# Altium schematic sheet MotionDetector.SchDoc
size A4
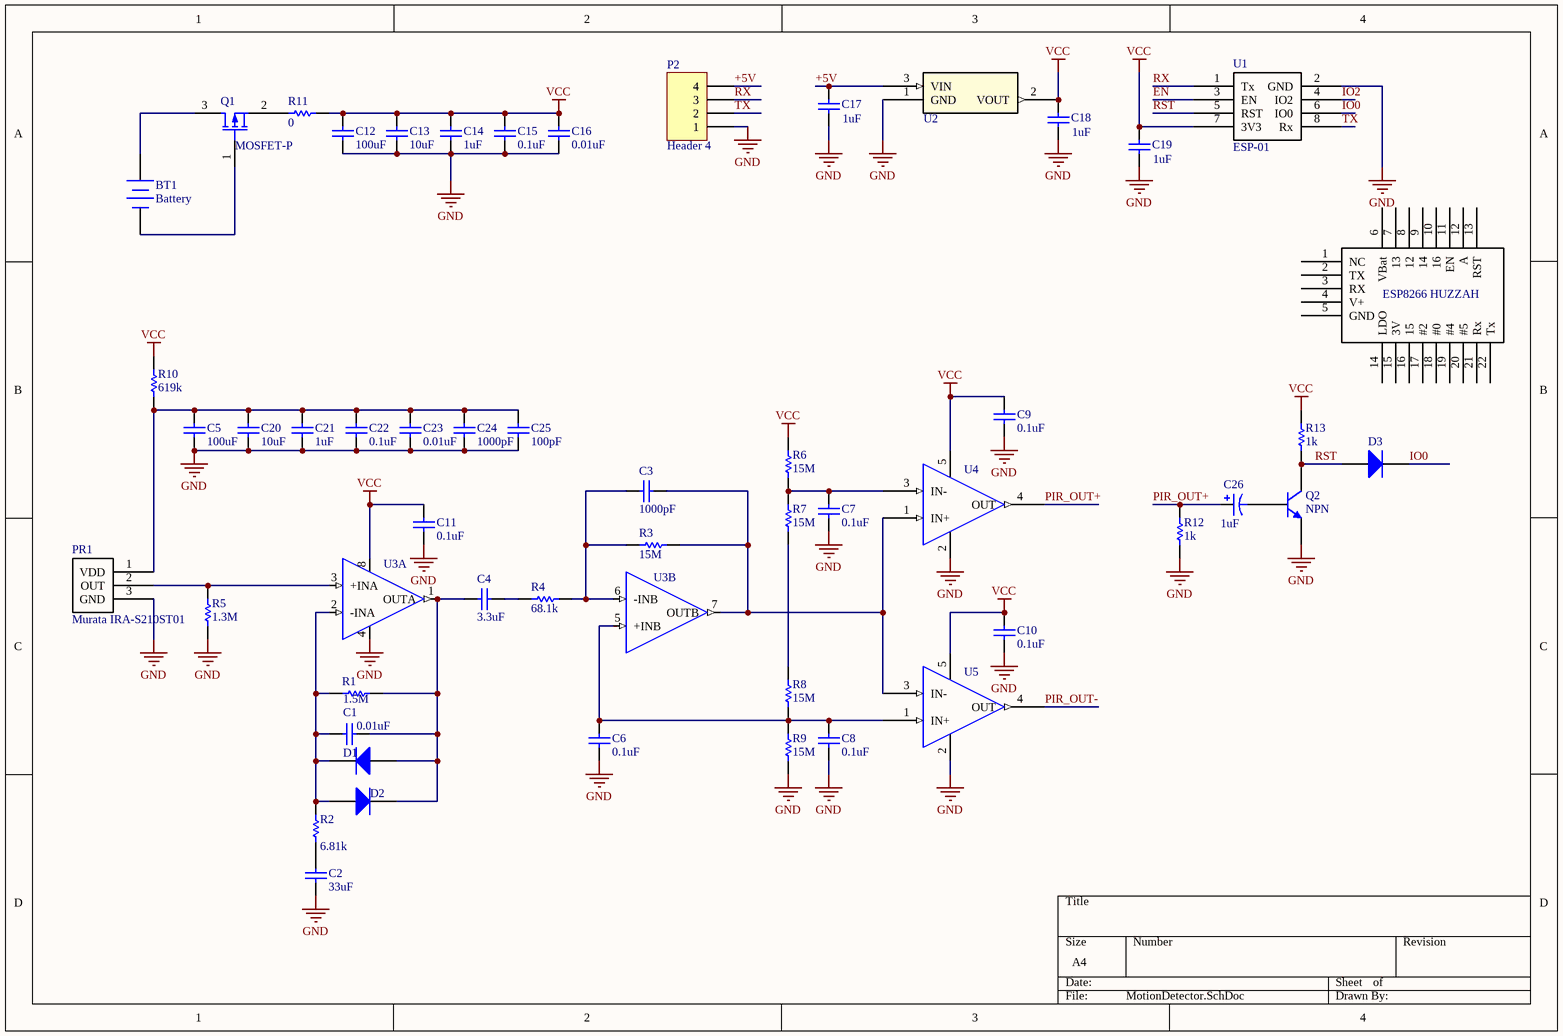
[diagram p0: MotionDetector.SchDoc]

## Parts
BT1  Battery  [BAT-2]
C1  value 0.01uF  [CAP_0804]  (hidden comment: Cap)
C2  value 33uF  [CAP_0804]  (hidden comment: Cap)
C3  value 1000pF  [CAP_0804]  (hidden comment: Cap)
C4  value 3.3uF  [CAP_0804]  (hidden comment: Cap)
C5  value 100uF  [CAP_0804]  (hidden comment: Cap)
C6  value 0.1uF  [CAP_0804]  (hidden comment: Cap)
C7  value 0.1uF  [CAP_0804]  (hidden comment: Cap)
C8  value 0.1uF  [CAP_0804]  (hidden comment: Cap)
C9  value 0.1uF  [CAP_0804]  (hidden comment: Cap)
C10  value 0.1uF  [CAP_0804]  (hidden comment: Cap)
C11  value 0.1uF  [CAP_0804]  (hidden comment: Cap)
C12  value 100uF  [CAP_0804]  (hidden comment: Cap)
C13  value 10uF  [CAP_0804]  (hidden comment: Cap)
C14  value 1uF  [CAP_0804]  (hidden comment: Cap)
C15  value 0.1uF  [CAP_0804]  (hidden comment: Cap)
C16  value 0.01uF  [CAP_0804]  (hidden comment: Cap)
C17  value 1uF  [CAP_0804]  (hidden comment: Cap)
C18  value 1uF  [CAP_0804]  (hidden comment: Cap)
C19  value 1uF  [CAP_0804]  (hidden comment: Cap)
C20  value 10uF  [CAP_0804]  (hidden comment: Cap)
C21  value 1uF  [CAP_0804]  (hidden comment: Cap)
C22  value 0.1uF  [CAP_0804]  (hidden comment: Cap)
C23  value 0.01uF  [CAP_0804]  (hidden comment: Cap)
C24  value 1000pF  [CAP_0804]  (hidden comment: Cap)
C25  value 100pF  [CAP_0804]  (hidden comment: Cap)
C26  value 1uF  [RB7.6-15]  (hidden comment: Cap Pol1)
D1  Diode  [Diode SOD123]  (value not drawn)
D2  Diode  [Diode SOD123]  (value not drawn)
D3  Diode  [Diode SOD123]  (value not drawn)
ESP8266_HUZZAH  Wifi module  [ESP8266 HUZZAH - duplicate]  (value not drawn)
P2  Header 4  [HDR1X4]
PR1  Murata IRA-S210ST01  [Murata IRA-S210ST01]
Q1  MOSFET-P  [TO-236]
Q2  NPN  [TO-226-AA]
R1  value 1.5M  [RES_0804_panasonic]  (hidden comment: Res1)
R2  value 6.81k  [RES_0804_panasonic]  (hidden comment: Res1)
R3  value 15M  [RES_0804_panasonic]  (hidden comment: Res1)
R4  value 68.1k  [RES_0804_panasonic]  (hidden comment: Res1)
R5  value 1.3M  [RES_0804_panasonic]  (hidden comment: Res1)
R6  value 15M  [RES_0804_panasonic]  (hidden comment: Res1)
R7  value 15M  [RES_0804_panasonic]  (hidden comment: Res1)
R8  value 15M  [RES_0804_panasonic]  (hidden comment: Res1)
R9  value 15M  [RES_0804_panasonic]  (hidden comment: Res1)
R10  value 619k  [RES_0804_panasonic]  (hidden comment: Res1)
R11  value 0  [RES_0804_panasonic]  (hidden comment: Res1)
R12  value 1k  [RES_0804_panasonic]  (hidden comment: Res1)
R13  value 1k  [RES_0804_panasonic]  (hidden comment: Res1)
U1  ESP-01  [ESP-01]
U2  Voltage Reg  [SOT-23]  (value not drawn)
U3  LPV802DGKR  [SOP65P490X110-8N]  (value not drawn)  (parts A,B of 2)
U4  TLV3691IDCKR  [DCK5-M]  (value not drawn)
U5  TLV3691IDCKR  [DCK5-M]  (value not drawn)

## Nets
GND: C2.1 C5.2 C6.1 C7.1 C8.1 C9.1 C10.1 C11.1 C12.2 C13.2 C14.2 C15.2 C16.2 C17.1 C18.1 C19.1 C20.2 C21.2 C22.2 C23.2 C24.2 C25.2 P2.1 PR1.3(GND) Q2.3(E) R5.2 R9.2 R12.2 U1.2(GND) U2.1(GND) U3.4(V-) U4.2(GND) U5.2(GND)
VCC: C9.2 C10.2 C11.2 C12.1 C13.1 C14.1 C15.1 C16.1 C18.2 C19.2 R6.1 R10.1 R11.1 R13.1 U1.7(3V3) U2.2(VOUT) U3.8(V+) U4.5(VCC) U5.5(VCC)
+5V: C17.2 P2.4 U2.3(VIN)
EN: U1.3(EN)
IO0: D3.2(K) U1.6(IO0)
IO2: U1.4(IO2)
PIR_OUT+: C26.1 R12.1 U4.4(OUT)
PIR_OUT-: U5.4(OUT)
RST: D3.1(A) Q2.1(C) R13.2 U1.5(RST)
RX: P2.3 U1.1(Tx)
TX: P2.2 U1.8(Rx)
NetBT1_1: BT1.1(+) Q1.3(D)
NetBT1_2: BT1.2(-) Q1.1(G)
NetC1_1: C1.1 D1.2(K) D2.1(A) R1.1 R2.2 U3.2(-INA)
NetC1_2: C1.2 C4.2 D1.1(A) D2.2(K) R1.2 U3.1(OUTA)
NetC2_2: C2.2 R2.1
NetC3_1: C3.1 R3.1 U3.7(OUTB) U4.1(IN+) U5.3(IN-)
NetC3_2: C3.2 R3.2 R4.1 U3.6(-INB)
NetC4_1: C4.1 R4.2
NetC5_1: C5.1 C20.1 C21.1 C22.1 C23.1 C24.1 C25.1 PR1.1(VDD) R10.2
NetC6_2: C6.2 C8.2 R8.2 R9.1 U3.5(+INB) U5.1(IN+)
NetC7_2: C7.2 R6.2 R7.1 U4.3(IN-)
NetC26_2: C26.2 Q2.2(B)
NetPR1_2: PR1.2(OUT) R5.1 U3.3(+INA)
NetQ1_2: Q1.2(S) R11.2
NetR7_2: R7.2 R8.1

Not connected (* = marked no-connect by the designer): ESP8266_HUZZAH 1(NC) 2(TX) 3(RX) 4(V+) 5(GND) 6(VBat) 7(13) 8(12) 9(14) 10(16) 11(EN) 12(A) 13(RST) 14(LDO) 15(3V) 16(15) 17(#2) 18(#0) 19(#4) 20(#5) 21(Rx) 22(Tx)

## Library data of the parts
BT1 = Battery: Multicell Battery; Published: 24-Mar-1999; LatestRevisionDate: 17-Jul-2002; LatestRevisionNote: Re-released for DXP Platform.; PackageReference: BAT-2; Publisher: Altium Limited; PackageDescription: Battery; 2 Leads
C1-C25 = Cap: Capacitor; Published: 8-Jun-2000; LatestRevisionDate: 17-Jul-2002; LatestRevisionNote: Re-released for DXP Platform.; PackageReference: RAD-0.3; Publisher: Altium Limited; PackageDescription: Radial Cap, Thru-Hole; 2 Leads; 0.3 in Pin Spacing
C26 = Cap Pol1: Polarized Capacitor (Radial); Published: 8-Jun-2000; LatestRevisionDate: 17-Jul-2002; LatestRevisionNote: Re-released for DXP Platform.; PackageReference: RB7.6-15; Publisher: Altium Limited; PackageDescription: Polarized Capacitor (Radial); 2 Leads
D1-D3 = Diode: Default Diode; Published: 8-Jun-2000; LatestRevisionDate: 17-Jul-2002; LatestRevisionNote: Re-released for DXP Platform.; PackageVersion: Sep-1996; PackageReference: SMC; Publisher: Altium Limited; PackageDescription: DO-214-AB/SMC; 2 C-Bend Leads; Body 7.9 x 5.9 mm, inc. leads (LxW); Code_JEDEC: DO-214-AB
ESP8266_HUZZAH = U1: U3
P2 = Header 4: Header, 4-Pin; LatestRevisionDate: 17-Jul-2002; LatestRevisionNote: Re-released for DXP Platform.; Publisher: Altium Limited
Q1 = MOSFET-P: P-Channel MOSFET; Published: 8-Jun-2000; LatestRevisionDate: 17-Jul-2002; LatestRevisionNote: Re-released for DXP Platform.; PackageVersion: 1995/1996; PackageReference: E3; Publisher: Altium Limited; PackageDescription: TO, Flat Index; 3 In-Line, Axial Leads; Body Dia. 4.6mm; Lead Dia. 0.5 mm (max)
Q2 = NPN: NPN Bipolar Transistor; Published: 8-Jun-2000; LatestRevisionDate: 17-Jul-2002; LatestRevisionNote: Re-released for DXP Platform.; PackageReference: TO-226-AA; Publisher: Altium Limited; PackageDescription: TO, Flat Index; 3 In-Line, Axial Leads; Body Dia. 4.8mm; Leads 0.55 x 0.51 mm (max); Code_JEDEC: TO-226-AA
R1-R13 = Res1: Resistor; Published: 8-Jun-2000; LatestRevisionDate: 17-Jul-2002; LatestRevisionNote: Re-released for DXP Platform.; PackageReference: AXIAL-0.3; Publisher: Altium Limited; PackageDescription: Axial Device, Thru-Hole; 2 Leads; 0.3 in Pin Spacing
U2 = AP2120N-3.3TRG1: Vendor: Diodes Inc; Built_By: EMA_UL_Team; Manufacturer_Part_Number: AP2120N-3.3TRG1; RefDes: RefDes; Type: DEV; Value: Value
U3 = LPV802DGKR: Dual Channel 320nA Nanopower Operational Amplifier 8-VSSOP -40 to 125; MF: Texas Instruments; Package: MSOP-8 Texas Instruments; Digi-Key_Purchase_URL: https://www.digikey.ca/product-detail/en/texas-instruments/LPV802DGKR/296-47341-1-ND/7688351?utm_source=snapeda&utm_medium=aggregator&utm_campaign=symbol; Digi-Key_Part_Number: 296-47341-1-ND; SnapEDA_Link: https://www.snapeda.com/parts/LPV802DGKR/Texas%20Instruments/view-part/?ref=snap; MP: LPV802DGKR; Value: *
U4 U5 = TLV3691IDCKR: Comparator; Vendor: Texas Instruments; Built_By: EMA_UL_Team; C: Copyright (C) 2016 Accelerated Designs. All rights reserved; Manufacturer_Part_Number: TLV3691IDCKR; RefDes: RefDes; Type: DEV; Value: Value